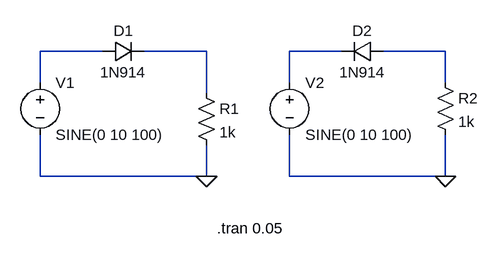
[diagram p0: schematic ltspice1.asc]
ltspice1.asc, the LTspice schematic file:
Version 4
SHEET 1 880 680
WIRE 112 -48 16 -48
WIRE 272 -48 176 -48
WIRE 480 -48 400 -48
WIRE 640 -48 544 -48
WIRE 16 0 16 -48
WIRE 400 0 400 -48
WIRE 640 0 640 -48
WIRE 272 16 272 -48
WIRE 16 144 16 80
WIRE 272 144 272 96
WIRE 272 144 16 144
WIRE 400 144 400 80
WIRE 640 144 640 80
WIRE 640 144 400 144
FLAG 272 144 0
FLAG 640 144 0
SYMBOL voltage 16 -16 R0
WINDOW 123 0 0 Left 0
WINDOW 39 0 0 Left 0
SYMATTR InstName V1
SYMATTR Value SINE(0 10 100)
SYMBOL voltage 400 -16 R0
WINDOW 123 0 0 Left 0
WINDOW 39 0 0 Left 0
SYMATTR InstName V2
SYMATTR Value SINE(0 10 100)
SYMBOL diode 112 -32 R270
WINDOW 0 32 32 VTop 2
WINDOW 3 0 32 VBottom 2
SYMATTR InstName D1
SYMATTR Value 1N914
SYMBOL diode 544 -64 R90
WINDOW 0 0 32 VBottom 2
WINDOW 3 32 32 VTop 2
SYMATTR InstName D2
SYMATTR Value 1N914
SYMBOL res 256 0 R0
SYMATTR InstName R1
SYMATTR Value 1k
SYMBOL res 624 -16 R0
SYMATTR InstName R2
SYMATTR Value 1k
TEXT 288 224 Left 2 !.tran 0.05

The netlist it stands for:
* ltspice1.asc
V1 N001 0 SINE(0 10 100)
V2 N003 0 SINE(0 10 100)
D1 N001 N002 1N914
D2 N004 N003 1N914
R1 N002 0 1k
R2 N004 0 1k
.model D D
.lib standard.dio
.tran 0.05
.backanno
.end